# Altium schematic sheet TestSheet.SchDoc
size A4
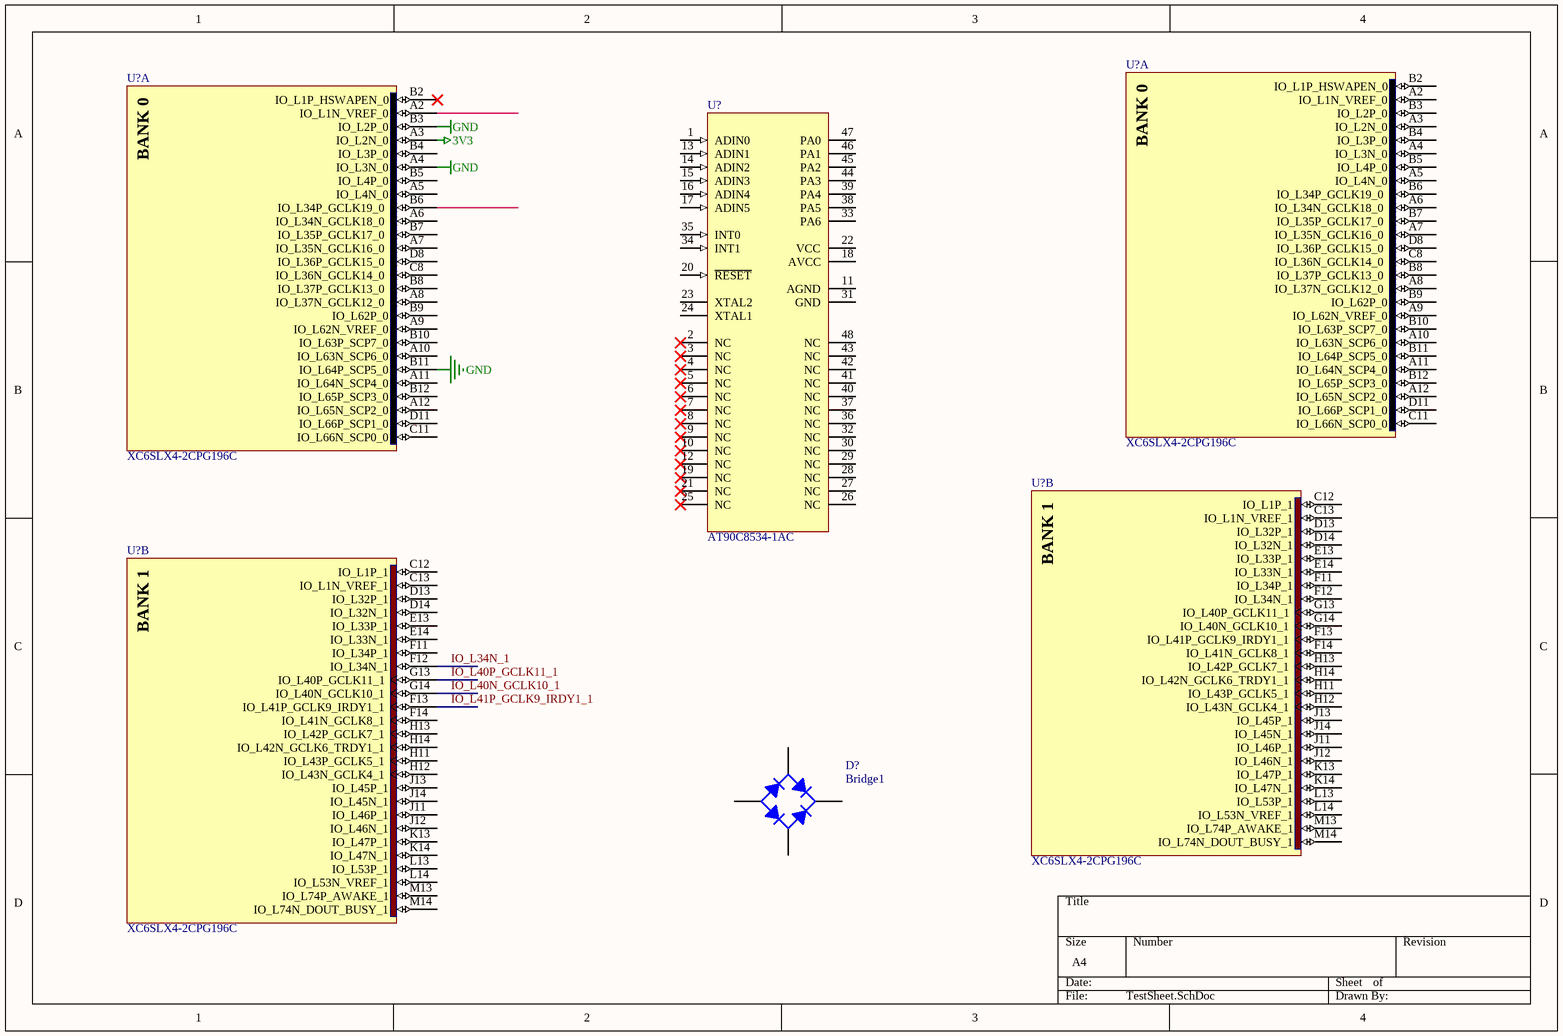
[diagram p0: TestSheet.SchDoc]

## Parts
(Parts that share a designator on the sheet are numbered #1, #2 ... from top to bottom, then left to right.)
D?  Bridge1  [D-38]
U?#1  XC6SLX4-2CPG196C  [CPG196]  (part A of 7)
U?#2  XC6SLX4-2CPG196C  [CPG196]  (part A of 7)
U?#3  AT90C8534-1AC  [48A_N]
U?#4  XC6SLX4-2CPG196C  [CPG196]  (part B of 7)
U?#5  XC6SLX4-2CPG196C  [CPG196]  (part B of 7)

## Nets
3V3: U?#2.A3(IO_L2N_0)
GND: U?#2.A4(IO_L3N_0) U?#2.B3(IO_L2P_0) U?#2.B11(IO_L64P_SCP5_0)
IO_L34N_1: U?#5.F12(IO_L34N_1)
IO_L40N_GCLK10_1: U?#5.G14(IO_L40N_GCLK10_1)
IO_L40P_GCLK11_1: U?#5.G13(IO_L40P_GCLK11_1)
IO_L41P_GCLK9_IRDY1_1: U?#5.F13(IO_L41P_GCLK9_IRDY1_1)

Not connected (* = marked no-connect by the designer): D? 1(K) 2(C) 3(A) 4(C); U?#1 A2(IO_L1N_VREF_0) A3(IO_L2N_0) A4(IO_L3N_0) A5(IO_L4N_0) A6(IO_L34N_GCLK18_0) A7(IO_L35N_GCLK16_0) A8(IO_L37N_GCLK12_0) A9(IO_L62N_VREF_0) A10(IO_L63N_SCP6_0) A11(IO_L64N_SCP4_0) A12(IO_L65N_SCP2_0) B2(IO_L1P_HSWAPEN_0) B3(IO_L2P_0) B4(IO_L3P_0) B5(IO_L4P_0) B6(IO_L34P_GCLK19_0) B7(IO_L35P_GCLK17_0) B8(IO_L37P_GCLK13_0) B9(IO_L62P_0) B10(IO_L63P_SCP7_0) B11(IO_L64P_SCP5_0) B12(IO_L65P_SCP3_0) C8(IO_L36N_GCLK14_0) C11(IO_L66N_SCP0_0) D8(IO_L36P_GCLK15_0) D11(IO_L66P_SCP1_0); U?#2 A2(IO_L1N_VREF_0) A5(IO_L4N_0) A6(IO_L34N_GCLK18_0) A7(IO_L35N_GCLK16_0) A8(IO_L37N_GCLK12_0) A9(IO_L62N_VREF_0) A10(IO_L63N_SCP6_0) A11(IO_L64N_SCP4_0) A12(IO_L65N_SCP2_0) B2(IO_L1P_HSWAPEN_0)* B4(IO_L3P_0) B5(IO_L4P_0) B6(IO_L34P_GCLK19_0) B7(IO_L35P_GCLK17_0) B8(IO_L37P_GCLK13_0) B9(IO_L62P_0) B10(IO_L63P_SCP7_0) B12(IO_L65P_SCP3_0) C8(IO_L36N_GCLK14_0) C11(IO_L66N_SCP0_0) D8(IO_L36P_GCLK15_0) D11(IO_L66P_SCP1_0); U?#3 1(ADIN0) 2(NC)* 3(NC)* 4(NC)* 5(NC)* 6(NC)* 7(NC)* 8(NC)* 9(NC)* 10(NC)* 11(AGND) 12(NC)* 13(ADIN1) 14(ADIN2) 15(ADIN3) 16(ADIN4) 17(ADIN5) 18(AVCC) 19(NC)* 20(~{RESET}) 21(NC)* 22(VCC) 23(XTAL2) 24(XTAL1) 25(NC)* 26(NC) 27(NC) 28(NC) 29(NC) 30(NC) 31(GND) 32(NC) 33(PA6) 34(INT1) 35(INT0) 36(NC) 37(NC) 38(PA5) 39(PA4) 40(NC) 41(NC) 42(NC) 43(NC) 44(PA3) 45(PA2) 46(PA1) 47(PA0) 48(NC); U?#4 C12(IO_L1P_1) C13(IO_L1N_VREF_1) D13(IO_L32P_1) D14(IO_L32N_1) E13(IO_L33P_1) E14(IO_L33N_1) F11(IO_L34P_1) F12(IO_L34N_1) F13(IO_L41P_GCLK9_IRDY1_1) F14(IO_L41N_GCLK8_1) G13(IO_L40P_GCLK11_1) G14(IO_L40N_GCLK10_1) H11(IO_L43P_GCLK5_1) H12(IO_L43N_GCLK4_1) H13(IO_L42P_GCLK7_1) H14(IO_L42N_GCLK6_TRDY1_1) J11(IO_L46P_1) J12(IO_L46N_1) J13(IO_L45P_1) J14(IO_L45N_1) K13(IO_L47P_1) K14(IO_L47N_1) L13(IO_L53P_1) L14(IO_L53N_VREF_1) M13(IO_L74P_AWAKE_1) M14(IO_L74N_DOUT_BUSY_1); U?#5 C12(IO_L1P_1) C13(IO_L1N_VREF_1) D13(IO_L32P_1) D14(IO_L32N_1) E13(IO_L33P_1) E14(IO_L33N_1) F11(IO_L34P_1) F14(IO_L41N_GCLK8_1) H11(IO_L43P_GCLK5_1) H12(IO_L43N_GCLK4_1) H13(IO_L42P_GCLK7_1) H14(IO_L42N_GCLK6_TRDY1_1) J11(IO_L46P_1) J12(IO_L46N_1) J13(IO_L45P_1) J14(IO_L45N_1) K13(IO_L47P_1) K14(IO_L47N_1) L13(IO_L53P_1) L14(IO_L53N_VREF_1) M13(IO_L74P_AWAKE_1) M14(IO_L74N_DOUT_BUSY_1)

## Notes on the sheet
- (in symbol XC6SLX4-2CPG196C, part A) BANK 0
- (in symbol XC6SLX4-2CPG196C, part B) BANK 1

## Library data of the parts
D? = Bridge1: Full Wave Diode Bridge; Published: 8-Jun-2000; LatestRevisionDate: 29-May-2009; LatestRevisionNote: Sch pins A & K swapped.; DatasheetVersion: E2732B; PackageReference: D-38; Publisher: Altium Limited; PackageDescription: Bridge Rectifier; 4 Terminals; Body 9.4 x 9.4 mm (typ); Pitch 5.08 mm
U?#1 U?#2 U?#4 U?#5 = XC6SLX4-2CPG196C: Spartan-6 LX 1.2V FPGA, 106 User I/Os, 196-Ball Chip-Scale BGA (0.5mm Pitch), Speed Grade 2, Commercial Grade, Pb-Free; Published: 1-Jul-2010; DatasheetVersion: ver1.6, Nov-2010; PackageVersion: ver1.0, Dec-2009; PackageReference: CPG196; Publisher: Altium Limited; PackageDescription: 196-Ball Chip Scale Ball Grid Array 0.5 mm Pitch (CPG196) - Pb-Free; Supplier 1: Digi-Key; Supplier Part Number 1: XC6SLX4-2CPG196C-ND; Code_JEDEC: MO-275; ComponentLink1Description: Manufacturer Link; ComponentLink1URL: http://www.xilinx.com; ComponentLink2Description: Spartan-6 Datasheet; ComponentLink2URL: http://www.xilinx.com/support/documentation/data_sheets/ds160.pdf; ComponentLink3Description: Spartan-6 Documents; ComponentLink3URL: http://www.xilinx.com/support/documentation/spartan-6.htm; ComponentLink4Description: Xilinx.com Home; ComponentLink4URL: http://www.xilinx.com
U?#3 = AT90C8534-1AC: 8-Bit AVR Microcontroller with 8K Bytes of Programmable Flash Memory; Published: 17-Sep-2003; LatestRevisionDate: 16-Oct-2006; LatestRevisionNote: IPC-7351 Footprint Added.; DatasheetVersion: 1229B-11/00; PackageVersion: rev1229B, Nov-2000; PackageReference: 48A; Publisher: Altium Limited; PackageDescription: 48-Pin Thin Quad Flat Pack 0.5 mm Pitch; ComponentLink1Description: Atmel.com Home; ComponentLink1URL: http://www.atmel.com